# EAGLE design pikado (EAGLE 5.06)
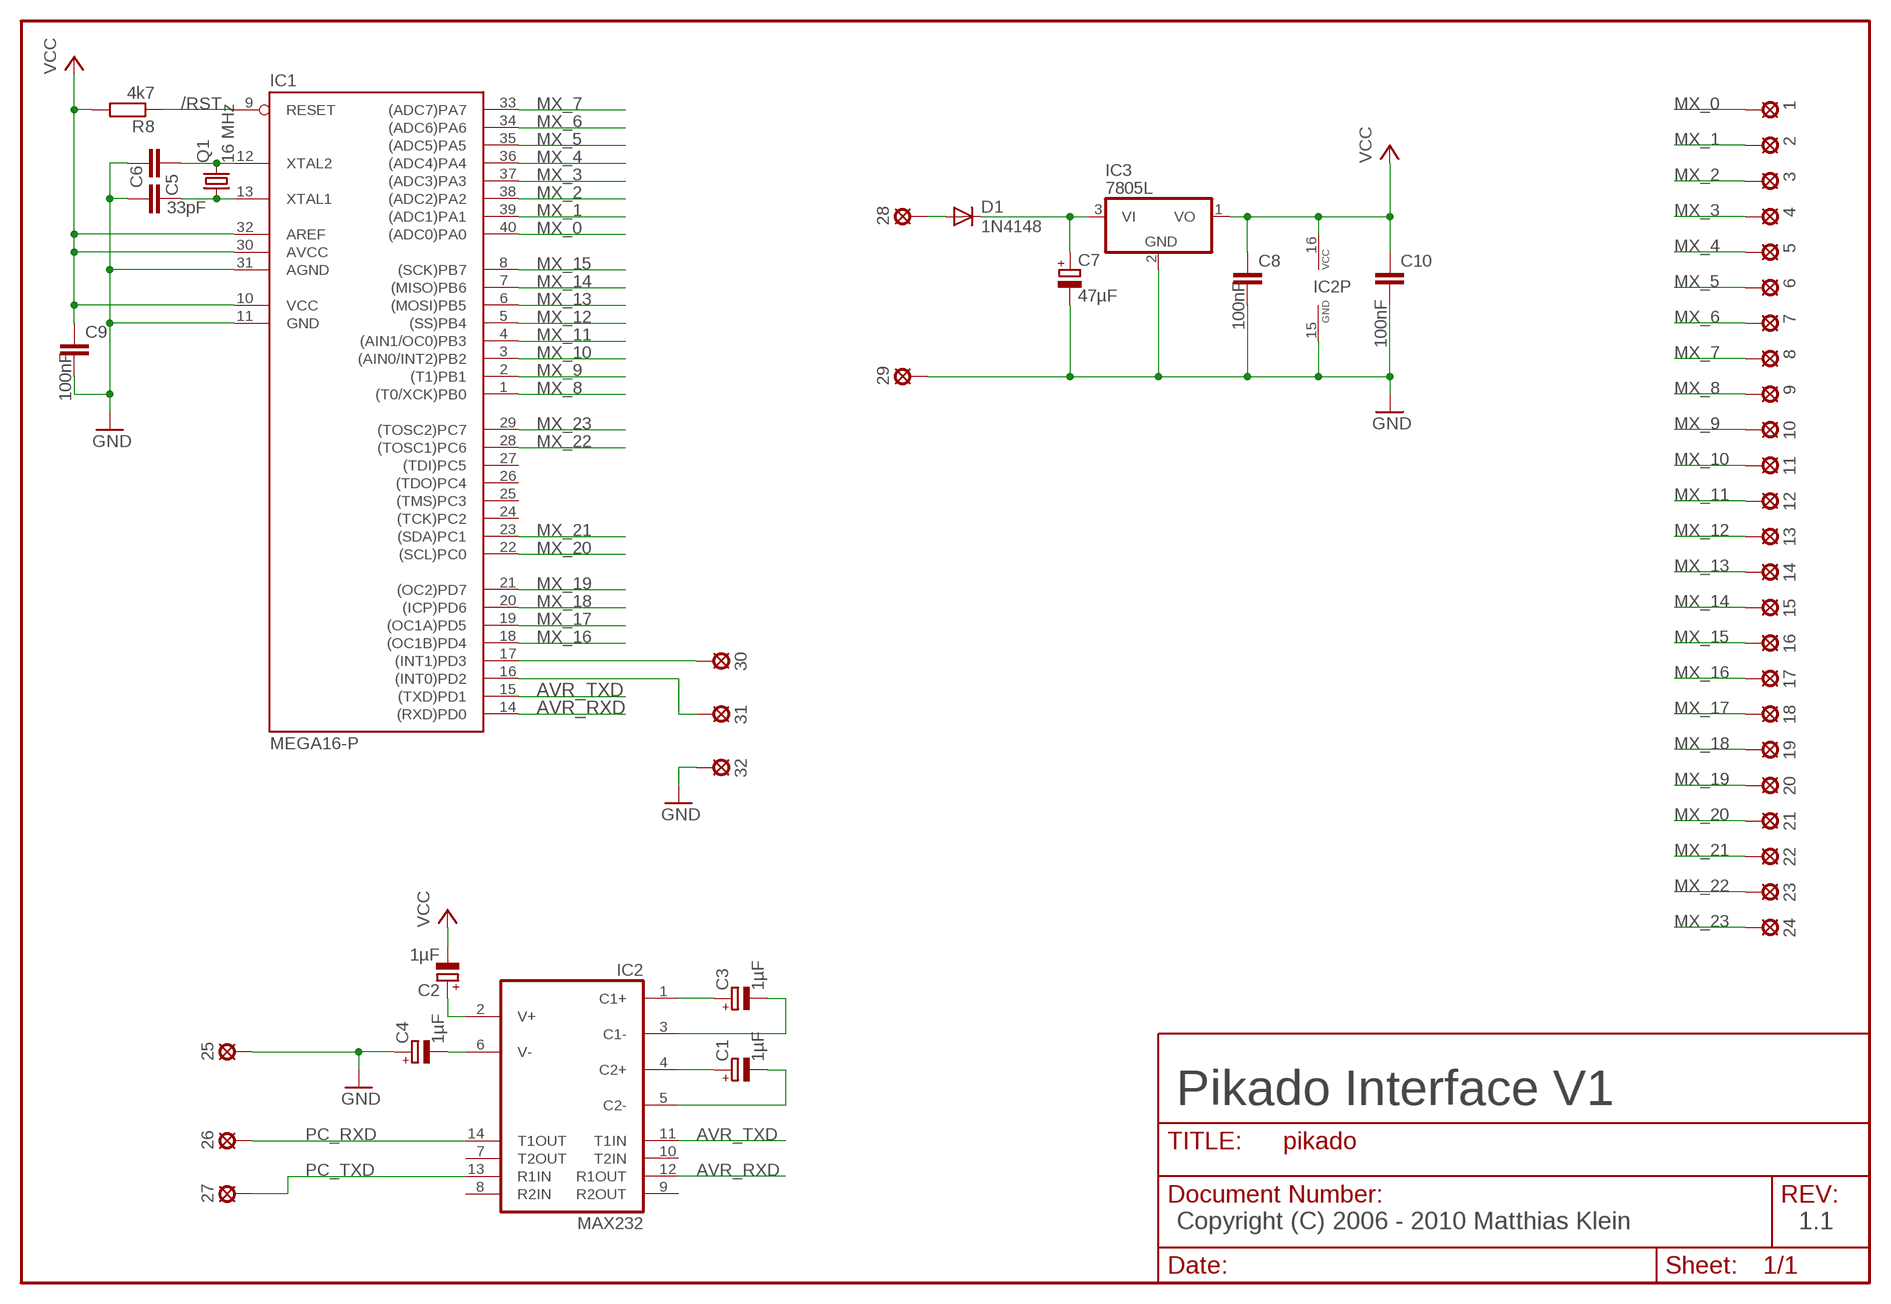
[diagram p0: schematic, sheet 1]

## Parts
1  LSP  [LSP]
2  LSP  [LSP]
3  LSP  [LSP]
4  LSP  [LSP]
5  LSP  [LSP]
6  LSP  [LSP]
7  LSP  [LSP]
8  LSP  [LSP]
9  LSP  [LSP]
10  LSP  [LSP]
11  LSP  [LSP]
12  LSP  [LSP]
13  LSP  [LSP]
14  LSP  [LSP]
15  LSP  [LSP]
16  LSP  [LSP]
17  LSP  [LSP]
18  LSP  [LSP]
19  LSP  [LSP]
20  LSP  [LSP]
21  LSP  [LSP]
22  LSP  [LSP]
23  LSP  [LSP]
24  LSP  [LSP]
25  LSP  [LSP]
26  LSP  [LSP]
27  LSP  [LSP]
28  LSP  [LSP]
29  LSP  [LSP]
30  LSP  [LSP]
31  LSP  [LSP]
32  LSP  [LSP]
C1  1µF  CPOL-EUE2.5-5  [E2,5-5]
C2  1µF  CPOL-EUE2.5-5  [E2,5-5]
C3  1µF  CPOL-EUE2.5-5  [E2,5-5]
C4  1µF  CPOL-EUE2.5-5  [E2,5-5]
C5  32pF  C-EU025-025X050  [C025-025X050]
C6  33pF  C-EU025-025X050  [C025-025X050]
C7  47µF  CPOL-EUE2-5  [E2-5]
C8  100nF  C-EU025-025X050  [C025-025X050]
C9  100nF  C-EU025-025X050  [C025-025X050]
C10  100nF  C-EU025-025X050  [C025-025X050]
D1  1N4148  [DO35-10]
IC1  MEGA16-P  [DIL40]
IC2  MAX232  [DIL16]
IC3  7805L  [TO92]
Q1  16 MHz  CRYTALHC49U70  [HC49U70]
R8  4k7  R-EU_0207/10  [0207/10]

## Nets
/RST: IC1.9(RESET) R8.1
AVR_RXD: IC1.14((RXD)PD0) IC2.12(R1OUT)
AVR_TXD: IC1.15((TXD)PD1) IC2.11(T1IN)
GND: 25.P$19(MP) 29.P$19(MP) 32.P$19(MP) C4.+ C5.2 C6.1 C7.- C8.2 C9.2 C10.2 IC1.11(GND) IC1.31(AGND) IC2.15(GND) IC3.2(GND)
MX_0: 1.P$19(MP) IC1.40((ADC0)PA0)
MX_1: 2.P$19(MP) IC1.39((ADC1)PA1)
MX_2: 3.P$19(MP) IC1.38((ADC2)PA2)
MX_3: 4.P$19(MP) IC1.37((ADC3)PA3)
MX_4: 5.P$19(MP) IC1.36((ADC4)PA4)
MX_5: 6.P$19(MP) IC1.35((ADC5)PA5)
MX_6: 7.P$19(MP) IC1.34((ADC6)PA6)
MX_7: 8.P$19(MP) IC1.33((ADC7)PA7)
MX_8: 9.P$19(MP) IC1.1((T0/XCK)PB0)
MX_9: 10.P$19(MP) IC1.2((T1)PB1)
MX_10: 11.P$19(MP) IC1.3((AIN0/INT2)PB2)
MX_11: 12.P$19(MP) IC1.4((AIN1/OC0)PB3)
MX_12: 13.P$19(MP) IC1.5((SS)PB4)
MX_13: 14.P$19(MP) IC1.6((MOSI)PB5)
MX_14: 15.P$19(MP) IC1.7((MISO)PB6)
MX_15: 16.P$19(MP) IC1.8((SCK)PB7)
MX_16: 17.P$19(MP) IC1.18((OC1B)PD4)
MX_17: 18.P$19(MP) IC1.19((OC1A)PD5)
MX_18: 19.P$19(MP) IC1.20((ICP)PD6)
MX_19: 20.P$19(MP) IC1.21((OC2)PD7)
MX_20: 21.P$19(MP) IC1.22((SCL)PC0)
MX_21: 22.P$19(MP) IC1.23((SDA)PC1)
MX_22: 23.P$19(MP) IC1.28((TOSC1)PC6)
MX_23: 24.P$19(MP) IC1.29((TOSC2)PC7)
N$1: C4.- IC2.6(V-)
N$2: C5.1 IC1.12(XTAL2) Q1.2
N$3: C6.2 IC1.13(XTAL1) Q1.1
N$4: 28.P$19(MP) D1.A
N$6: C7.+ D1.C IC3.3(VI)
N$7: 30.P$19(MP) IC1.17((INT1)PD3)
N$8: C3.+ IC2.1(C1+)
N$9: C1.+ IC2.4(C2+)
N$10: C3.- IC2.3(C1-)
N$11: C1.- IC2.5(C2-)
N$12: C2.+ IC2.2(V+)
N$13: 31.P$19(MP) IC1.16((INT0)PD2)
PC_RXD: 26.P$19(MP) IC2.14(T1OUT)
PC_TXD: 27.P$19(MP) IC2.13(R1IN)
VCC: C2.- C8.1 C9.1 C10.1 IC1.10(VCC) IC1.30(AVCC) IC1.32(AREF) IC2.16(VCC) IC3.1(VO) R8.2
Unconnected: IC1.24((TCK)PC2) IC1.25((TMS)PC3) IC1.26((TDO)PC4) IC1.27((TDI)PC5) IC2.7(T2OUT) IC2.8(R2IN) IC2.9(R2OUT) IC2.10(T2IN)

## Notes on the sheet
- Pikado Interface V1
- Copyright (C) 2006 - 2010 Matthias Klein | 1.1

## Library data of the parts
1-32 = Draht_Via:LSP
C1-C4 C7 = rcl:CPOL-EU: POLARIZED CAPACITOR, European symbol
C5 C6 C8-C10 = rcl:C-EU: CAPACITOR, European symbol
D1 = diode:1N4148: DIODE high speed (Philips)
IC1 = avr:MEGA16-P: MICROCONTROLLER 16 Kbytes FLASH 1 kbytes SRAM 512 bytes EEPROM USART 8-channel 10 bit ADC
IC2 = maxim:MAX232: RS232 TRANSEIVER
IC3 = linear:78*: Positive VOLTAGE REGULATOR Source: http://cache.national.com/ds/LM/LM78L05.pdf http://www.fairchildsemi.com/ds/LM/LM7805.pdf
Q1 = crystal:CRYTAL: CRYSTAL
R8 = rcl:R-EU_: RESISTOR, European symbol

## Board
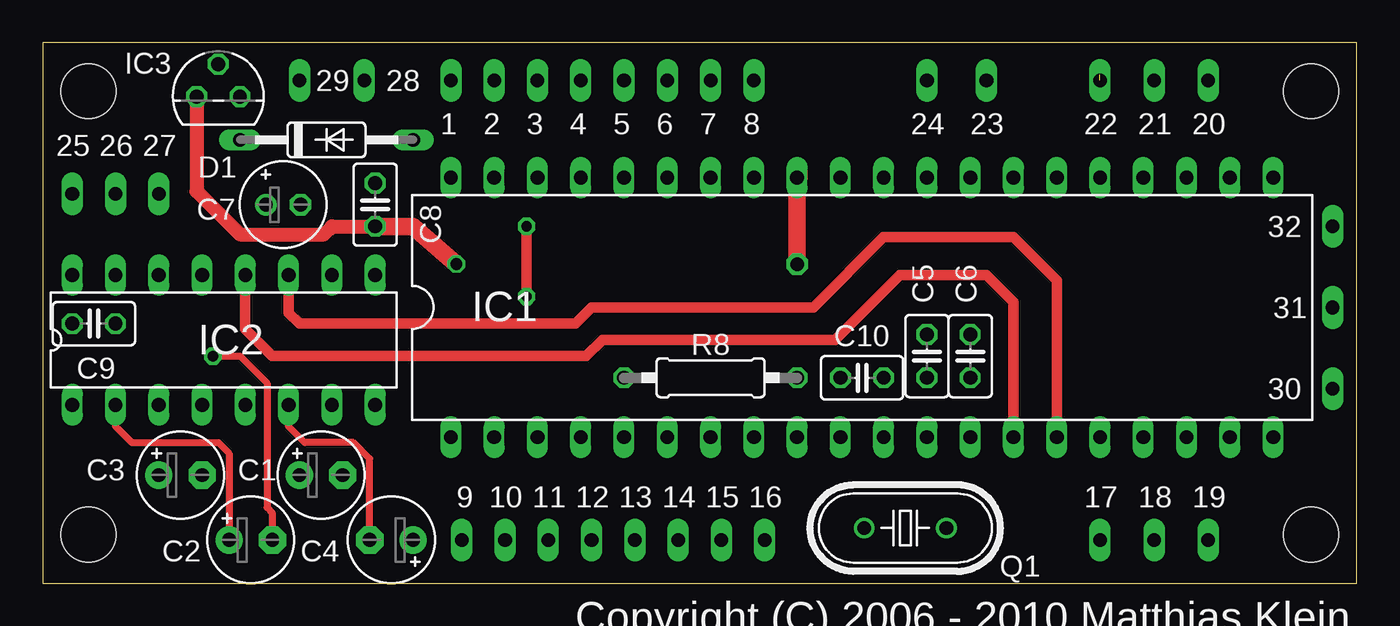
[diagram p1: board, top side]
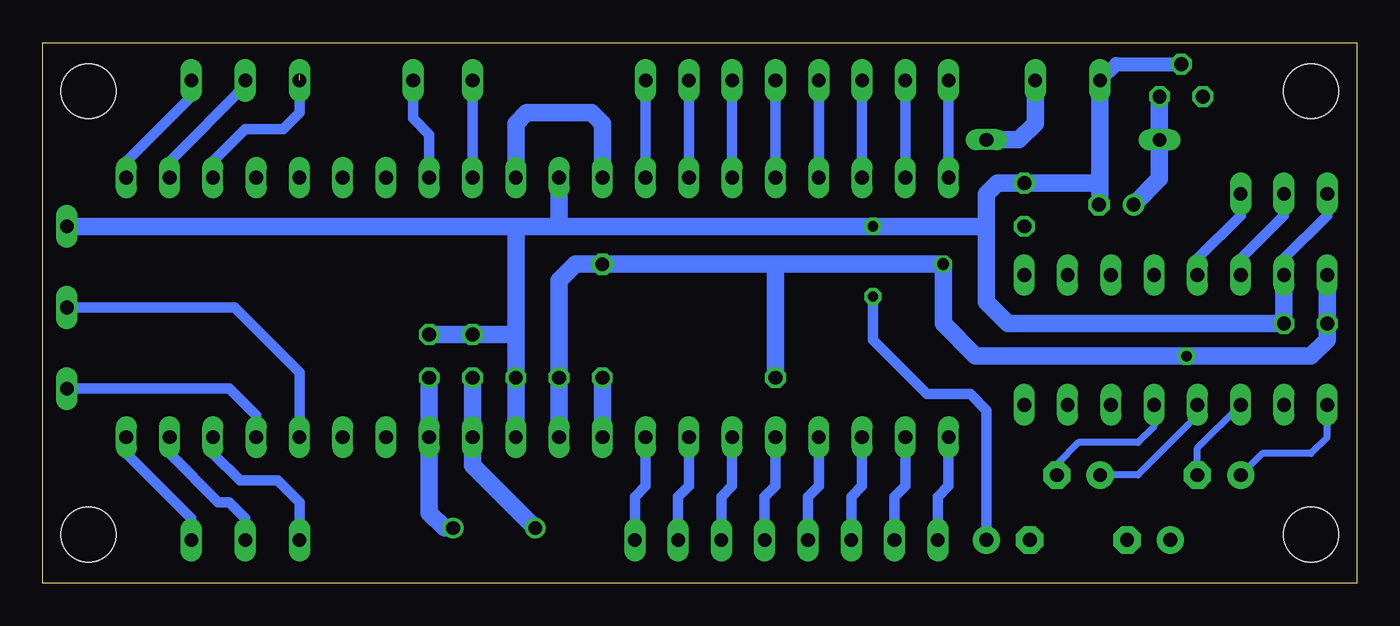
[diagram p2: board, bottom side, seen from below]

Size 77.14 x 31.74 mm. Coordinates in mm from the lower left corner, seen from the top.
Outline: 0,0 77.14,0 77.14,31.74 0,31.74 0,0
Copper layers (1*16): Top 0.035mm / dielectric 1.5mm / Bottom 0.035mm
Design rules "PCB-POOL": minimum track width 6mil, minimum drill 12mil, track to track 6mil, track to pad 6mil, pad to pad 6mil, via to via 6mil, smd to smd 6mil, copper to edge 20mil, drill to drill 8mil, minimum pad ring 8mil, minimum via ring 6mil, stop-mask expansion 3mil, vias tented up to drill 0mil, thermal gap 8mil
Holes 3.2 mm at 2.69,28.89 2.69,2.85 74.45,28.89 74.45,2.85

### Footprints (pad centres in the part's own frame; a part is rotated, then mirrored left to right if it is on the bottom)
LSP = drill 0.8 pad 1.27 long: P$19 0,0
E2,5-5 = drill 0.813 pad 1.6 round: + -1.27,0 | drill 0.813 pad 1.6 octagon: - 1.27,0
C025-025X050 = drill 0.813 octagon: 1 -1.27,0; 2 1.27,0
E2-5 = drill 0.813 pad 1.27 round: + -1.016,0 | drill 0.813 pad 1.27 octagon: - 1.016,0
DO35-10 = drill 0.813 long: A 5.08,0; C -5.08,0
DIL40 = drill 0.813 long: 1 -24.13,-7.62; 2 -21.59,-7.62; 3 -19.05,-7.62; 4 -16.51,-7.62; 5 -13.97,-7.62; 6 -11.43,-7.62; 7 -8.89,-7.62; 8 -6.35,-7.62; 9 -3.81,-7.62; 10 -1.27,-7.62; 11 1.27,-7.62; 12 3.81,-7.62; 13 6.35,-7.62; 14 8.89,-7.62; 15 11.43,-7.62; 16 13.97,-7.62; 17 16.51,-7.62; 18 19.05,-7.62; 19 21.59,-7.62; 20 24.13,-7.62; 21 24.13,7.62; 22 21.59,7.62; 23 19.05,7.62; 24 16.51,7.62; 25 13.97,7.62; 26 11.43,7.62; 27 8.89,7.62; 28 6.35,7.62; 29 3.81,7.62; 30 1.27,7.62; 31 -1.27,7.62; 32 -3.81,7.62; 33 -6.35,7.62; 34 -8.89,7.62; 35 -11.43,7.62; 36 -13.97,7.62; 37 -16.51,7.62; 38 -19.05,7.62; 39 -21.59,7.62; 40 -24.13,7.62
DIL16 = drill 0.813 long: 1 -8.89,-3.81; 2 -6.35,-3.81; 3 -3.81,-3.81; 4 -1.27,-3.81; 5 1.27,-3.81; 6 3.81,-3.81; 7 6.35,-3.81; 8 8.89,-3.81; 9 8.89,3.81; 10 6.35,3.81; 11 3.81,3.81; 12 1.27,3.81; 13 -1.27,3.81; 14 -3.81,3.81; 15 -6.35,3.81; 16 -8.89,3.81
TO92 = drill 0.813 octagon: 1 -1.27,0; 2 0,1.905; 3 1.27,0
HC49U70 = drill 0.813 round: 1 -2.413,0; 2 2.413,0
0207/10 = drill 0.813 octagon: 1 -5.08,0; 2 5.08,0

### Placement (x,y rotation side)
1  23.96,29.52 0 top
2  26.51,29.52 0 top
3  29.05,29.52 0 top
4  31.59,29.52 0 top
5  34.12,29.52 0 top
6  36.66,29.52 0 top
7  39.2,29.52 0 top
8  41.74,29.52 0 top
9  24.6,2.54 0 top
10  27.14,2.54 0 top
11  29.68,2.54 0 top
12  32.22,2.54 0 top
13  34.76,2.54 0 top
14  37.3,2.54 0 top
15  39.84,2.54 0 top
16  42.38,2.54 0 top
17  62.06,2.54 0 top
18  65.24,2.54 0 top
19  68.41,2.54 0 top
20  68.41,29.52 0 top
21  65.24,29.52 0 top
22  62.06,29.52 0 top
23  55.4,29.52 0 top
24  51.91,29.52 0 top
25  1.74,22.86 0 top
26  4.28,22.86 0 top
27  6.82,22.86 0 top
28  18.89,29.52 0 top
29  15.08,29.52 0 top
30  75.72,11.42 0 top
31  75.72,16.19 0 top
32  75.72,20.95 0 top
C1  16.35,6.34 0 top
C2  12.22,2.54 0 top
C3  8.09,6.34 0 top
C4  20.47,2.54 180 top
C5  51.91,13.33 90 top
C6  54.45,13.33 270 top
C7  14.12,22.22 0 top
C8  19.52,22.22 90 top
C9  3.01,15.23 0 top
C10  48.09,12.06 0 top
D1  16.66,26.03 0 top
IC1  48.09,16.19 0 top
IC2  10.63,14.28 0 top
IC3  10.31,28.57 0 top
Q1  50.63,3.23 180 top
R8  39.2,12.06 180 top

### Tracks (layer width: path | path; a pad name or v marks a point on that pad's centre or on a via)
/RST
  Bottom 1.016: IC1.9 R8.1
AVR_RXD
  Top 0.61: IC1.14 56.98,16.51 55.4,18.09 50.32,18.09 46.51,14.28 32.86,14.28 31.9,13.33 13.49,13.33 11.9,14.92 IC2.12
AVR_TXD
  Top 0.61: IC2.11 14.44,15.87 15.08,15.23 31.27,15.23 32.22,16.19 45.24,16.19 49.37,20.32 56.98,20.32 59.52,17.78 IC1.15
GND  (via drill 0.6 pad 1.02)
  Top 0.61: v28.41,20.95 v28.41,16.82
  Bottom 0.61: C4.+ 21.74,10.15 22.7,11.11 25.23,11.11 28.41,14.28 v28.41,16.82 | IC2.15 4.28,19.05 1.74,21.59 25.P$19
  Bottom 0.813: IC3.2 14.12,30.48 29.P$19
  Bottom 1.016: IC1.11 C10.2 49.37,14.6 | C6.1 C5.2 49.37,14.6 | IC2.15 C9.2 20.47,15.23 21.74,16.51 21.74,20.95 | C7.- 15.08,22.28 15.08,23.49 | 15.08,23.49 29.P$19 | 15.08,23.49 C8.2 21.11,23.49 21.74,22.86 21.74,20.95 | 46.83,20.95 IC1.31 | 21.74,20.95 v28.41,20.95 46.83,20.95 | 46.83,20.95 49.37,20.95 | 49.37,20.95 32.P$19 | 49.37,20.95 49.37,14.6
MX_0
  Bottom 0.61: IC1.40 1.P$19
MX_1
  Bottom 0.61: IC1.39 2.P$19
MX_2
  Bottom 0.61: IC1.38 3.P$19
MX_3
  Bottom 0.61: 4.P$19 31.27,29.52 31.59,29.21 IC1.37
MX_4
  Bottom 0.61: IC1.36 5.P$19
MX_5
  Bottom 0.61: IC1.35 6.P$19
MX_6
  Bottom 0.61: 39.2,29.84 7.P$19 IC1.34
MX_7
  Bottom 0.61: IC1.33 8.P$19
MX_8
  Bottom 0.61: 9.P$19 24.6,5.08 23.96,5.71 IC1.1
MX_9
  Bottom 0.61: 10.P$19 27.14,5.08 26.51,5.71 IC1.2
MX_10
  Bottom 0.61: 11.P$19 29.68,5.08 29.05,5.71 IC1.3
MX_11
  Bottom 0.61: 12.P$19 32.22,5.08 31.59,5.71 IC1.4
MX_12
  Bottom 0.61: 13.P$19 34.76,5.08 34.12,5.71 IC1.5
MX_13
  Bottom 0.61: 14.P$19 37.3,5.08 36.66,5.71 IC1.6
MX_14
  Bottom 0.61: 15.P$19 39.84,5.08 39.2,5.71 IC1.7
MX_15
  Bottom 0.61: 16.P$19 42.38,5.08 41.74,5.71 IC1.8
MX_16
  Bottom 0.61: IC1.18 67.14,7.62 65.56,6.03 63.34,6.03 62.06,4.76 17.P$19
MX_17
  Bottom 0.61: IC1.19 69.68,7.62 66.83,4.76 66.19,4.76 65.24,3.81 18.P$19
MX_18
  Bottom 0.61: IC1.20 72.22,7.62 68.41,3.81 19.P$19 68.41,2.22
MX_19
  Bottom 0.61: IC1.21 72.22,24.76 68.41,28.57 20.P$19
MX_20
  Bottom 0.61: IC1.22 69.68,24.76 65.24,29.21 21.P$19
MX_21  (1 unrouted)
  Bottom 0.61: IC1.23 67.14,24.76 65.24,26.67 63.02,26.67 62.06,27.62 22.P$19
MX_22
  Bottom 0.61: IC1.28 54.45,26.35 55.4,27.3 55.4,28.89 55.08,29.21 23.P$19
MX_23
  Bottom 0.61: IC1.29 24.P$19
N$1
  Top 0.406: C4.- 19.2,7.3 18.25,8.25 15.39,8.25 14.44,9.2 IC2.6
N$2
  Bottom 1.016: Q1.2 51.91,6.92 IC1.12 C5.1
N$3
  Bottom 1.016: Q1.1 53.56,3.23 54.45,4.12 IC1.13 C6.2
N$4
  Bottom 1.016: D1.A 19.84,26.03 18.89,26.98 28.P$19
N$6
  Bottom 1.016: C7.+ 11.58,23.74 D1.C IC3.3
N$7
  Bottom 0.61: 30.P$19 66.19,11.42 64.6,9.84 IC1.17
N$8
  Bottom 0.406: C3.+ 5.55,7.62 2.69,7.62 1.74,8.57 IC2.1
N$9
  Bottom 0.406: C1.+ 12.85,6.34 9.36,9.84 IC2.4
N$10
  Bottom 0.406: C3.- 9.36,7.93 IC2.3
N$11
  Bottom 0.406: IC2.5 11.9,9.2 12.85,8.25 16.35,8.25 17.62,6.98 C1.-
N$12
  Top 0.406: C2.+ 10.95,7.62 10.31,8.25 5.23,8.25 4.28,9.2 IC2.2
N$13
  Bottom 0.61: 31.P$19 65.88,16.19 62.06,12.38 IC1.16
PC_RXD
  Bottom 0.61: IC2.14 6.82,19.05 4.28,21.59 26.P$19
PC_TXD
  Bottom 0.61: IC2.13 9.36,19.05 6.82,21.59 27.P$19
VCC  (via drill 0.6 pad 1.02, 0.7, 0.8 pad 1.27)
  Top 0.406: C2.- 13.49,4.12 13.17,4.44 13.17,11.74 11.58,13.33 v10,13.33
  Top 0.813: IC3.1 9.04,23.01 11.58,20.47 16.5,20.47 16.98,20.95 C8.1
  Top 1.016: v44.29,18.73 IC1.32 | v24.28,18.73 21.74,20.95 C8.1
  Top 1.27: IC1.32 44.29,24.12
  Bottom 1.016: 34.12,18.73 v24.28,18.73 24.28,15.23 22.38,13.33 v10,13.33 2.69,13.33 1.74,14.28 C9.1 IC2.16 | 34.12,18.73 v44.29,18.73 45.87,18.73 46.83,17.78 C10.1 IC1.10 | IC1.30 49.37,26.98 48.73,27.62 44.92,27.62 44.29,26.98 IC1.32 | 34.12,18.73 R8.2

### Text on the board
tNames: Copyright (C) 2006 - 2010 Matthias Klein